# Altium schematic sheet 5V_MAIN.SchDoc
size A4; SheetNumber: 5; SheetTotal: 8
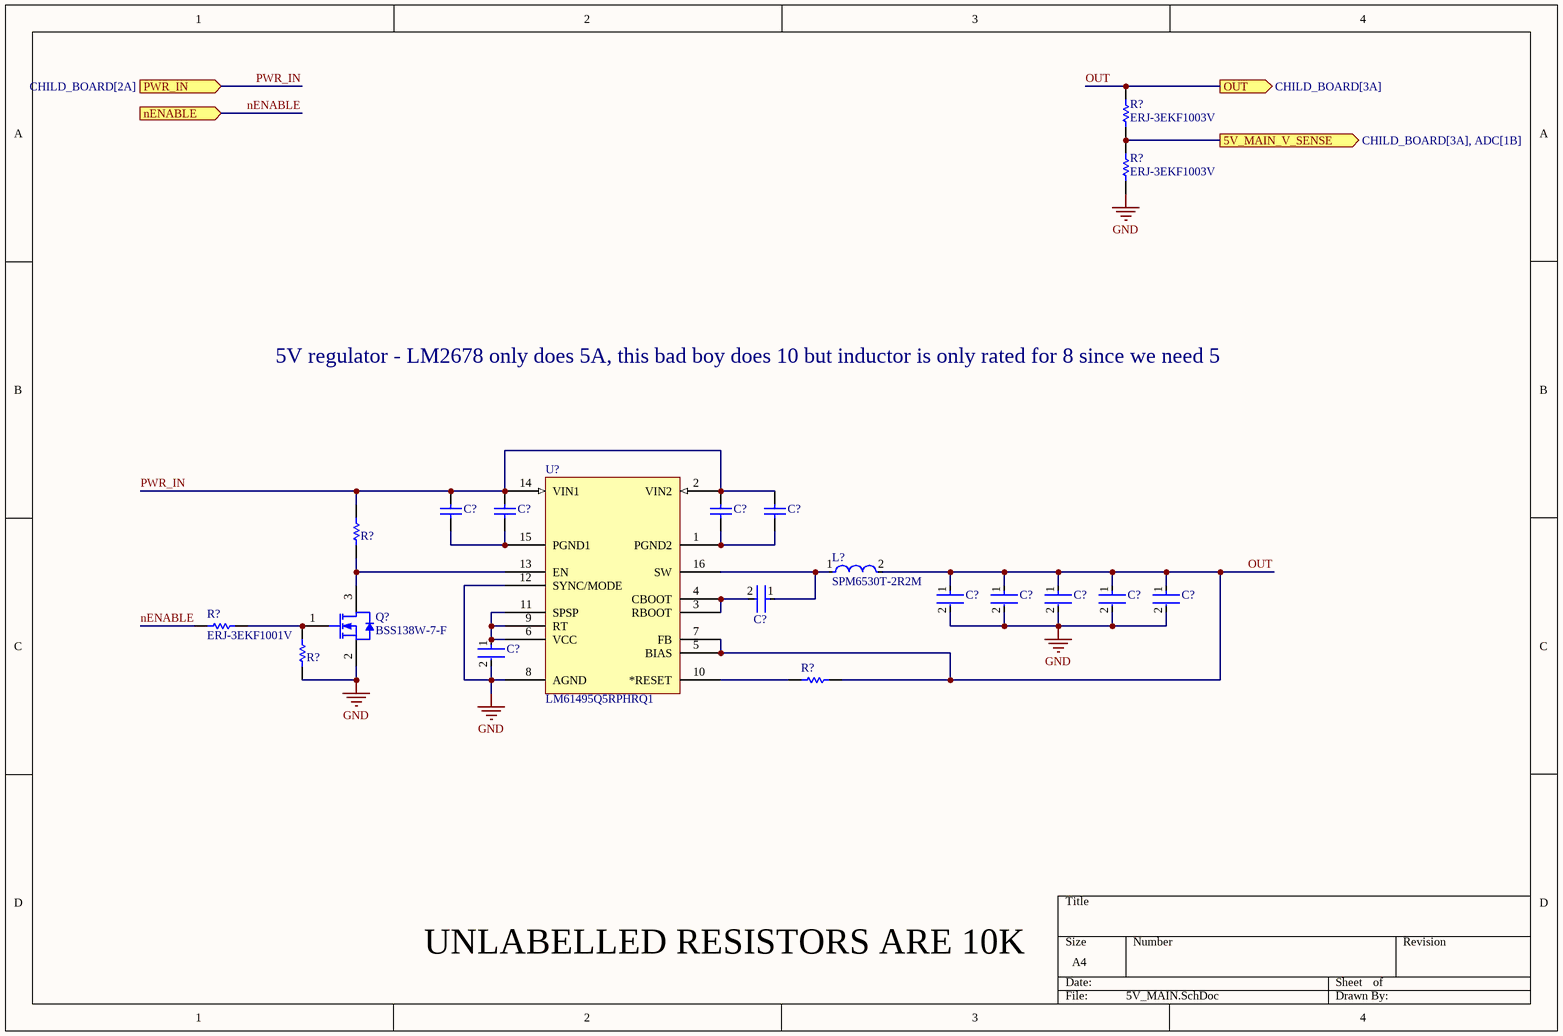
[diagram p0: 5V_MAIN.SchDoc]

## Parts
(Parts that share a designator on the sheet are numbered #1, #2 ... from top to bottom, then left to right.)
C?#1  GRM219R61E106KA12D  [CAPC2013X95X45ML10T25]  (value not drawn)
C?#2  CAP 470nF 50V 1812(4532)  [CAPC1812(4532)125_M]  (value not drawn)
C?#3  CAP 470nF 50V 1812(4532)  [CAPC1812(4532)125_M]  (value not drawn)
C?#4  GRM219R61E106KA12D  [CAPC2013X95X45ML10T25]  (value not drawn)
C?#5  GRM21BR61E226ME44L  [FP-GRM21B-0_2-e0_2_0_7-IPC_B]  (value not drawn)
C?#6  GRM21BR61E226ME44L  [FP-GRM21B-0_2-e0_2_0_7-IPC_B]  (value not drawn)
C?#7  GRM21BR61E226ME44L  [FP-GRM21B-0_2-e0_2_0_7-IPC_B]  (value not drawn)
C?#8  GRM21BR61E226ME44L  [FP-GRM21B-0_2-e0_2_0_7-IPC_B]  (value not drawn)
C?#9  GRM21BR61E226ME44L  [FP-GRM21B-0_2-e0_2_0_7-IPC_B]  (value not drawn)
C?#10  C1005X7R1H104K050BB  [FP-C1005-050-0_05-IPC_C]  (value not drawn)
C?#11  UMK107AB7105KA-T  [FP-0603-L_1_6_0_15-W_0_8-IPC_C]  (value not drawn)
L?  SPM6530T-2R2M  [FP-SPM6530-MFG]
Q?  BSS138W-7-F  [DIOD-SOT323-3_V]
R?#1  ERJ-3EKF1003V  [RESC1608X55X30ML15T15]
R?#2  ERJ-3EKF1003V  [RESC1608X55X30ML15T15]
R?#3  ERJ3EKF1002V  [RESC1609X55X30LL15T15]  (value not drawn)
R?#4  ERJ-3EKF1001V  [RESC1608X55X30LL15T15]
R?#5  ERJ3EKF1002V  [RESC1609X55X30LL15T15]  (value not drawn)
R?#6  ERJ3EKF1002V  [RESC1609X55X30LL15T15]  (value not drawn)
U?  LM61495Q5RPHRQ1  [LM61495Q5RPHRQ1-Footprint-1]

## Ports
5V_MAIN_V_SENSE (out, see CHILD_BOARD[3A], ADC[1B]), nENABLE (in), OUT (out, see CHILD_BOARD[3A]), PWR_IN (in, see CHILD_BOARD[2A])

## Nets
GND: C?#5.2 C?#6.2 C?#7.2 C?#8.2 C?#9.2 C?#11.2 Q?.2(S) R?#2.1 R?#5.1 U?.8(AGND) U?.12(SYNC/MODE)
5V_MAIN_V_SENSE: R?#1.1 R?#2.2 ; port 5V_MAIN_V_SENSE
nENABLE: R?#4.1 ; port nENABLE
OUT: C?#5.1 C?#6.1 C?#7.1 C?#8.1 C?#9.1 L?.2 R?#1.2 R?#6.2 U?.5(BIAS) U?.7(FB) ; port OUT
PWR_IN: C?#1.2 C?#2.2 C?#3.2 C?#4.2 R?#3.2 U?.2(VIN2) U?.14(VIN1) ; port PWR_IN
NetC?#1_1: C?#1.1 C?#2.1 U?.15(PGND1)
NetC?#3_1: C?#3.1 C?#4.1 U?.1(PGND2)
NetC?#10_1: C?#10.1 L?.1 U?.16(SW)
NetC?#10_2: C?#10.2 U?.3(RBOOT) U?.4(CBOOT)
NetC?#11_1: C?#11.1 U?.6(VCC) U?.9(RT) U?.11(SPSP)
NetQ?_1: Q?.1(G) R?#4.2 R?#5.2
NetQ?_3: Q?.3(D) R?#3.1 U?.13(EN)
NetR?#6_1: R?#6.1 U?.10(*RESET)

## Notes on the sheet
- 5V regulator - LM2678 only does 5A, this bad boy does 10 but inductor is only rated for 8 since we need 5
- UNLABELLED RESISTORS ARE 10K

## Library data of the parts
C?#1 C?#4 = CMP-2007-00182-1: Manufacturer: Murata; Part Number: GRM219R61E106KA12D
C?#2 C?#3 = CMP-1040-01539-1: CAP 470nF 50V ±10% 1812 (4532 Metric) Thickness 1.25mm SMD; Tolerance: Â±10%; Case-Metric: 4532; Case-EIA: 1812; Technology: SMT; Max Thickness: 1.25 mm; Value: 470nF; Rated Voltage: 50 V
C?#5-C?#9 = CMP-2007-03222-3: Chip Multilayer Ceramic Capacitors for General Purpose, 0805, 22uF, X5R, 15%, 20%, 25V; Case/Package: 0805; Depth: 1.25mm; Resistor Type: Ceramic; Voltage Rating: 25V; Lead Free: Lead Free; Voltage Rating (DC): 25V; Case Code (Metric): 2012; Thickness: 0.057inch; REACH SVHC: No SVHC; Material: Ceramic; Tolerance: 20%; Length: 2mm; Capacitance: 22uF; Case Code (Imperial): 0805; Max Operating Temperature: 85°C; Termination: SMD/SMT; Weight: 0.000335oz; Dielectric: X5R; Packaging: Tape and Reel; Voltage: 25V; Package Quantity: 3000; Height: 1.25mm; Mount: Surface Mount; Width: 1.25mm; Min Operating Temperature: -55°C
C?#10 = CMP-2000-05393-2: Multilayer Ceramic Capacitors 100nF ±10% 50V X7R SMD 0402; Voltage: 50V; Dielectric Material: Ceramic; Min Operating Temperature: -55°C; Depth: 0.5mm; Radiation Hardening: No; RoHS Compliant: Yes; Voltage Rating (DC): 50V; Lead Free: Lead Free; Resistor Type: Ceramic; Height: 0.5mm; Dielectric: X7R; Thickness: 0.022inch; Case/Package: 0402; Case Code (Metric): 1005; Termination: SMD/SMT; Capacitance: 100nF; Packaging: Tape and Reel; Max Operating Temperature: 125°C; Mount: Surface Mount; Package Quantity: 1; Width: 0.02inch; Weight: 2.3E-05oz; Voltage Rating: 50V; Tolerance: 10%; Construction: Flat; Case Code (Imperial): 0402; Length: 1mm; REACH SVHC: No SVHC; Series: C
C?#11 = CMP-2000-07531-4: Ceramic Capacitor General Use 1uF ±10% 50V X7R 0603; Series: M; Width: 0.031inch; Mount: Surface Mount; Radiation Hardening: No; Voltage Rating (DC): 50V; Packaging: Tape and Reel; Termination: SMD/SMT; Depth: 0.8mm; Case Code (Metric): 1608; Case Code (Imperial): 0603; Height: 0.8mm; Voltage Rating: 50V; Package Quantity: 1; Halogen Free: Halogen Free; Dielectric: X7R; Min Operating Temperature: -55°C; Length: 1.6mm; Construction: Flat; Tolerance: 10%; Thickness: 0.037inch; Max Operating Temperature: 125°C; Case/Package: 0603; Capacitance: 1uF; RoHS Compliant: Yes
L? = CMP-08253-000021-1: FIXED IND 2.2UH 8.2A 19 MOHM SMD; Manufacturer: TDK; Test Frequency: 100kHz; Shielding: true; Standoff Height: 0.15mm; Core Material: Metal; Saturation Current: 8.4A; Tolerance: 20%; Series Resistance: 19.1mΩ; Automotive: No; Octopart: https://octopart.com/spm6530t-2r2m-tdk-18903909; Mouser Description: Fixed Inductors 2.2uH 0.0173ohms 7.1x6.5x3mm; ComponentLink2URL: https://product.tdk.com/info/en/catalog/datasheets/inductor_commercial_power_spm6530_en.pdf; Height: 3mm; Device Class L2: Inductors; Package: SPM6530; Rms Current: 8.2A; ComponentLink2Description: Datasheet; RoHS: TRUE; Temperature Range Low: -40°C; Digikey Description: FIXED IND 2.2UH 8.2A 19 MOHM SMD; Device Class L1: Passive Components; Device Class L3: Fixed Inductors; Value: 2.2uH; Temperature Range High: +125°C; Inductance: 2.2uH; Temperature: -40°C to +125°C; Lead Free: Yes; Manufacturer Part Number: SPM6530T-2R2M; Composition: Wirewound; Category: Ind
Q? = CMP-2000-05968-1: N-Channel Enhancement Mode Mosfet, 50 V, 200 mA, -55 to 150 degC, 6-Pin SOT-323, RoHS, Tape and Reel; Typical Turn-Off Delay Time: 20ns; Number of Channels: 1Channel; Type: EnhancementModeFieldEffectTransistor; Brand: DiodesIncorporated; Vds - Drain-Source Breakdown Voltage: 75V; Vgs - Gate-Source Voltage: 20V; Rds On - Drain-Source Resistance: 1.4Ohms; Transistor Type: 1N-Channel; Configuration: Single; Unit Weight: 0.000212oz; Pd - Power Dissipation: 200mW; Id - Continuous Drain Current: 200mA; Forward Transconductance - Min: 0.1S; Manufacturer URL: http://www.diodes.com/; Series: BSS138; Package Description: 3-Pin Small Outline Transistor, Body 2 x 1.25 mm, Pitch 0.65 mm; Mounting Technology: SurfaceMount; Product Category: MOSFET; RoHS: True; Maximum Operating Temperature: +150C; Height: 1mm; Length: 2.2mm; Technology: Si; Width: 1.35mm; Datasheet URL: http://www.diodes.com/_files/datasheets/ds30206.pdf; Manufacturer: DiodesIncorporated; Package / Case: SOT-323-3; Typical Turn-On Delay Time: 20ns; Transistor Polarity: N-Channel; Factory Pack Quantity: 3000; Packaging: Reel; Product: MOSFETSmallSignal; Datasheet Version: Rev. 11-2, 09/2013; Package Reference: SOT323; Minimum Operating Temperature: -55C; Mounting Style: SMD/SMT; Channel Mode: Enhancement
R?#1 R?#2 = CMP-2000-00182-1: Manufacturer: Panasonic; Part Number: ERJ-3EKF1003V
R?#3 R?#5 R?#6 = CMP-1012-00623-3: Chip Resistor, 10 KOhm, +/- 1%, 0.1 W, -55 to 155 degC, 0603 (1608 Metric), RoHS, Tape and Reel; Manufacturer: Panasonic; Voltage Rating: 75V; Case\/Package: 0603; Power Rating: 100mW; Resistance: 10KOhm; Temperature Coefficient: 100ppm\/degreesC; Number of Pins: 2; Package Reference: 603; Depth: 0.8mm; Mount: SurfaceMount; Package Description: 2-Pin Surface Mount Device, Body 1.6 x 0.85 mm; Datasheet Version: 02/2017; Length: 1.6mm; Lead Free: LeadFree; Height: 0.45mm; Number of Terminations: 2; Max Power Dissipation: 100mW; Min Operating Temperature: -55degC; Datasheet URL: https://industrial.panasonic.com/cdbs/www-data/pdf/RDA0000/AOA0000C304.pdf; Termination: SMD/SMT; Case Code (Metric): 1608; Case Code (Imperial): 0603; Tolerance: 1%; Max Operating Temperature: 155degC; RoHSCompliant: true; Voltage Rating (DC): 75V; Radiation Hardening: No; Packaging: TapeandReel; Composition: ThickFilm; Mounting Technology: SurfaceMount; Manufacturer URL: http://www.panasonic.com/; Width: 0.031inch; REACH SVHC: NoSVHC; Contact Plating: Tin; Military Standard: Not; Package Quantity: 1
R?#4 = CMP-2000-00180-1: Manufacturer: Panasonic; Part Number: ERJ-3EKF1001V
U? = CMP-019-00059-1: 10-A automotive buck converter optimized for power density and low EMI 16-VQFN-HR -40 to 150